# Altium schematic sheet optOutput.SchDoc
size 420 x 297 mm; Scale: 1:1; DocumentType: Схема электрическая принципиальная; FirstReferrence: АБВГ.123456.001
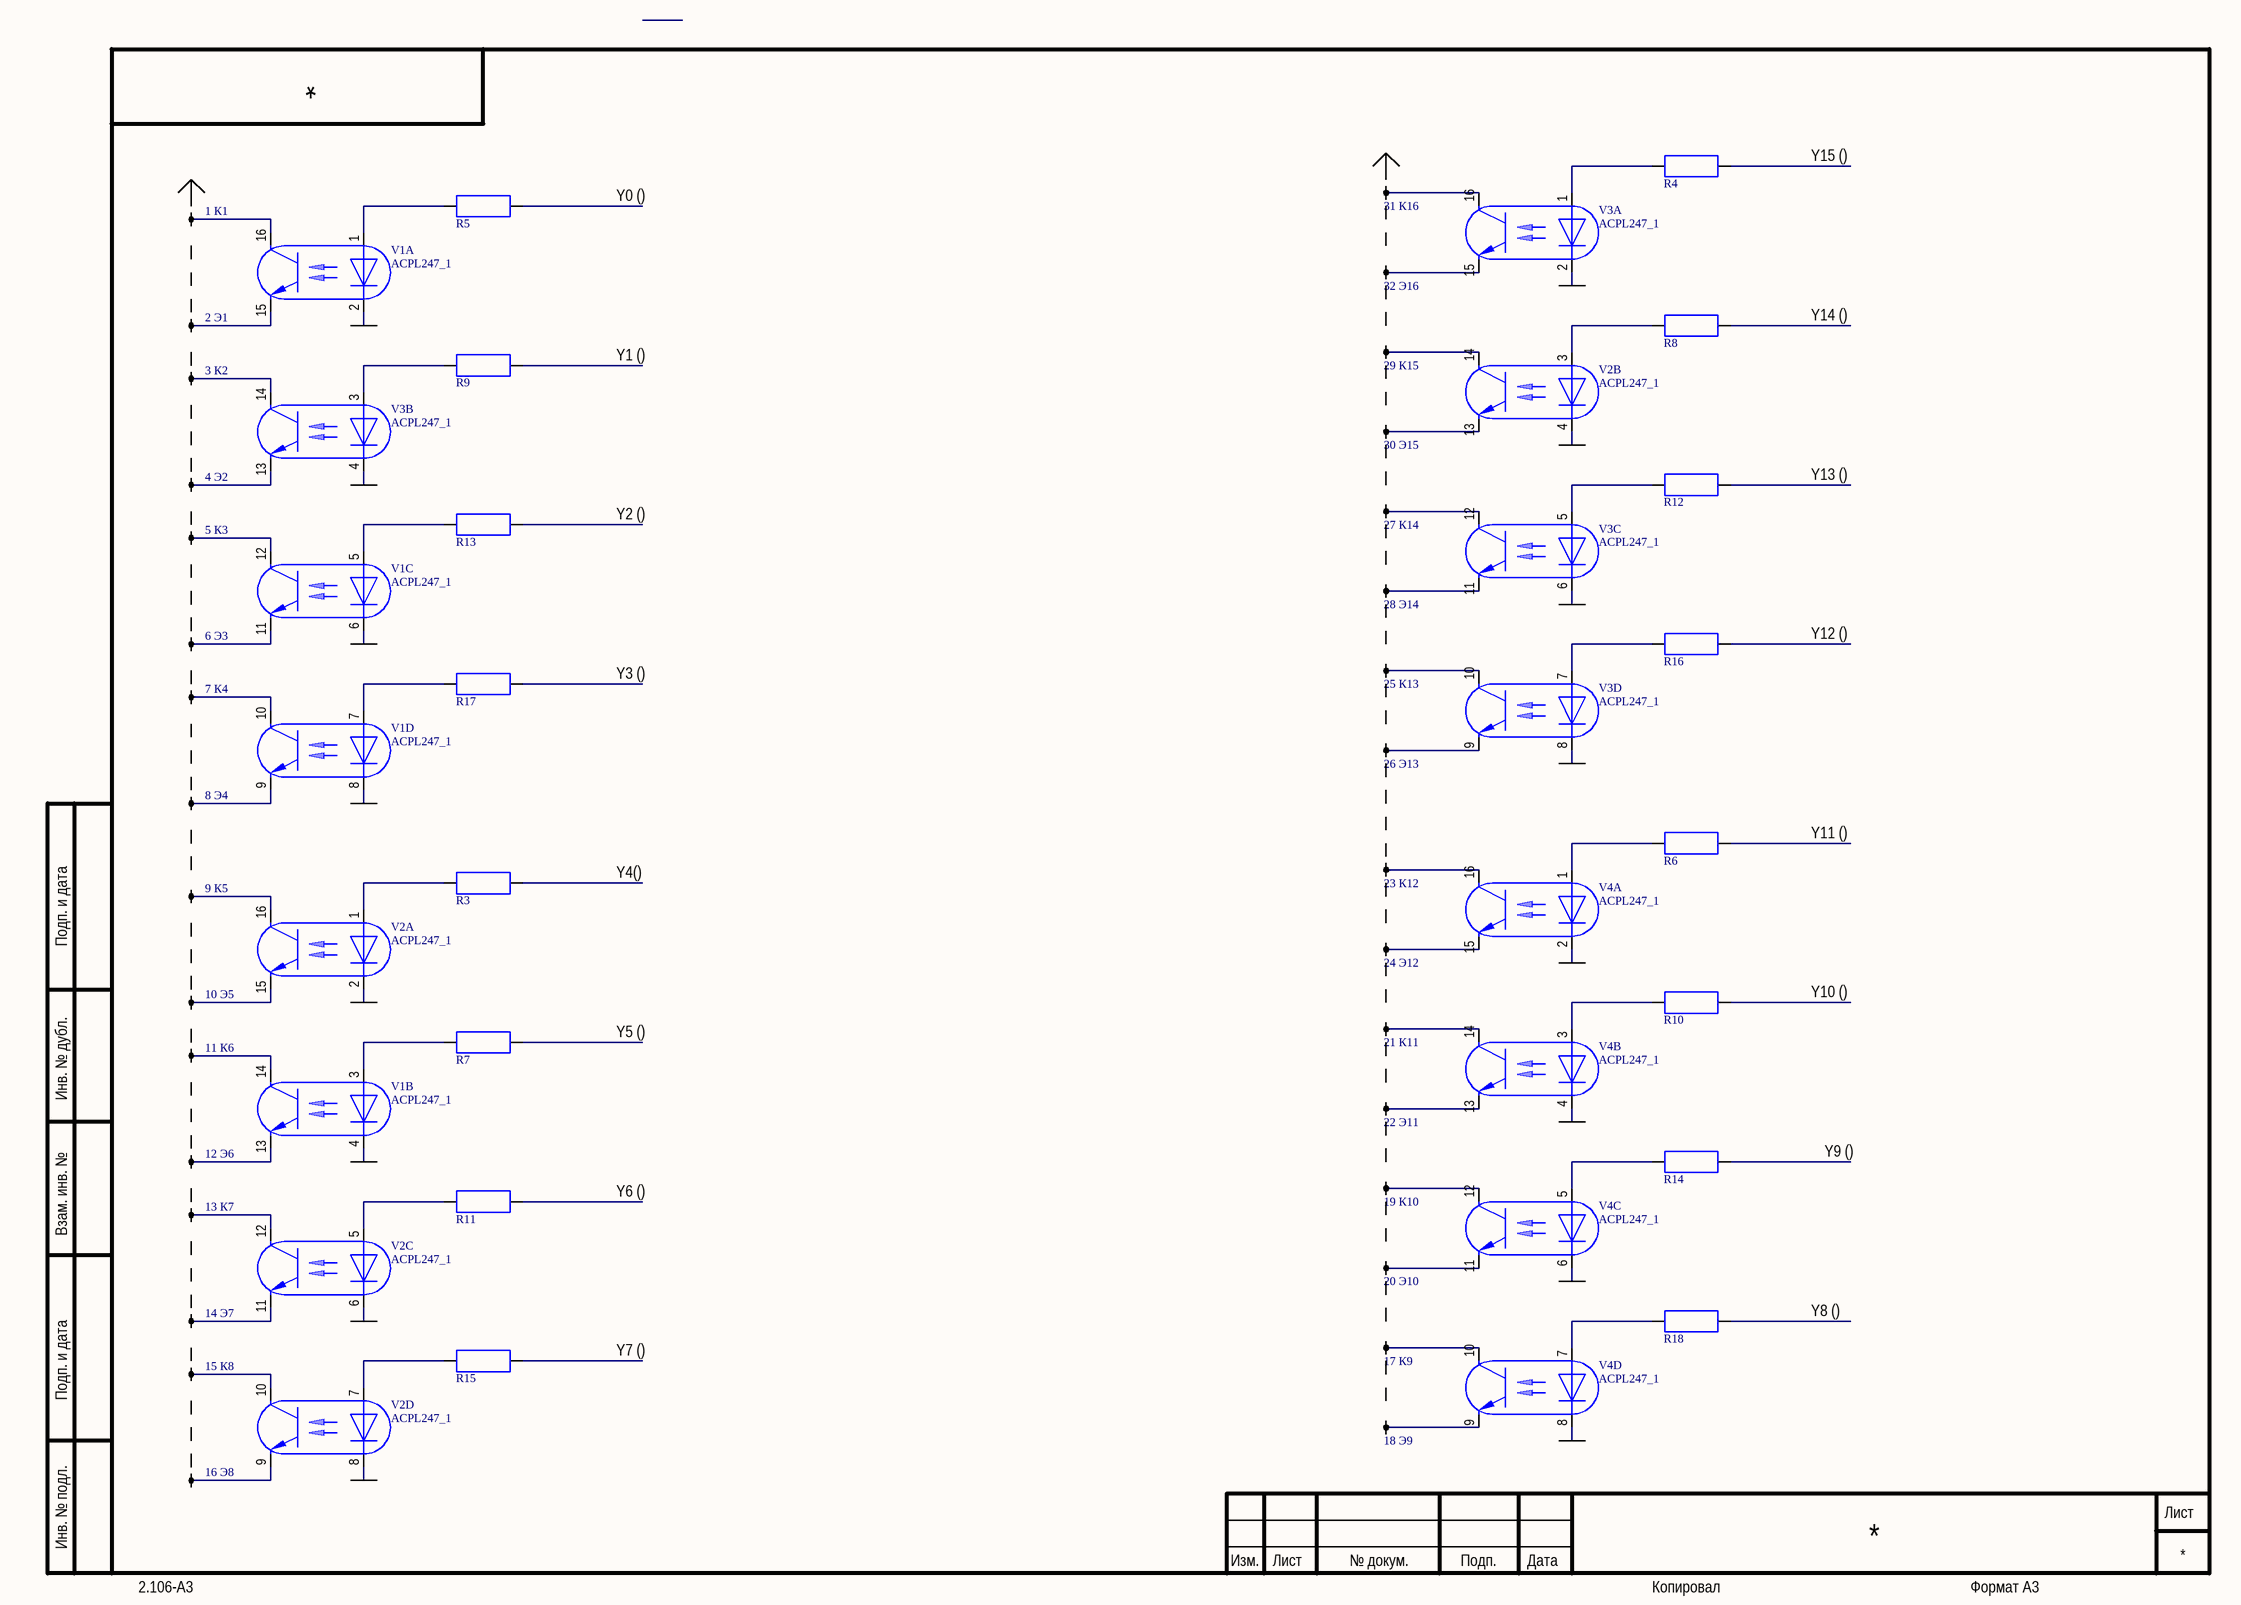
[diagram p0: optOutput.SchDoc]

## Parts
(Parts that share a designator on the sheet are numbered #1, #2 ... from top to bottom, then left to right.)
R3  R_1  (value not drawn)
R4  R_1  (value not drawn)
R5  R_1  (value not drawn)
R6  R_1  (value not drawn)
R7  R_1  (value not drawn)
R8  R_1  (value not drawn)
R9  R_1  (value not drawn)
R10  R_1  (value not drawn)
R11  R_1  (value not drawn)
R12  R_1  (value not drawn)
R13  R_1  (value not drawn)
R14  R_1  (value not drawn)
R15  R_1  (value not drawn)
R16  R_1  (value not drawn)
R17  R_1  (value not drawn)
R18  R_1  (value not drawn)
V1  ACPL247_1  [SOP127P700X220-16N]  (parts A,B,C,D of 4)
V2  ACPL247_1  [SOP127P700X220-16N]  (parts A,B,C,D of 4)
V3  ACPL247_1  [SOP127P700X220-16N]  (parts A,B,C,D of 4)
V4  ACPL247_1  [SOP127P700X220-16N]  (parts A,B,C,D of 4)
X2#1  1 К1  [PLD64]  (parts A,B,C,D,H,I,J,K,L,M,N,O,P,Q,R,S,T,U,V,W,X,Y,Z,27,28,29,30,31,32 of 64)
X2#2  5 К3  [PLD64]  (part E of 64)
X2#3  6 Э3  [PLD64]  (part F of 64)
X2#4  7 К4  [PLD64]  (part G of 64)

## Nets
NetR3_1: R3.1 V2.1
NetR4_1: R4.1 V3.1
NetR5_1: R5.1 V1.1
NetR6_1: R6.1 V4.1
NetR7_1: R7.1 V1.3
NetR8_1: R8.1 V2.3
NetR9_1: R9.1 V3.3
NetR10_1: R10.1 V4.3
NetR11_1: R11.1 V2.5
NetR12_1: R12.1 V3.5
NetR13_1: R13.1 V1.5
NetR14_1: R14.1 V4.5
NetR15_1: R15.1 V2.7
NetR16_1: R16.1 V3.7
NetR17_1: R17.1 V1.7
NetR18_1: R18.1 V4.7
NetV1_9: V1.9 X2#1.8
NetV1_10: V1.10 X2#4.43
NetV1_11: V1.11 X2#3.41
NetV1_12: V1.12 X2#2.39
NetV1_13: V1.13 X2#1.12
NetV1_14: V1.14 X2#1.11
NetV1_15: V1.15 X2#1.2
NetV1_16: V1.16 X2#1.1
NetV2_9: V2.9 X2#1.16
NetV2_10: V2.10 X2#1.15
NetV2_11: V2.11 X2#1.14
NetV2_12: V2.12 X2#1.13
NetV2_13: V2.13 X2#1.30
NetV2_14: V2.14 X2#1.29
NetV2_15: V2.15 X2#1.10
NetV2_16: V2.16 X2#1.9
NetV3_9: V3.9 X2#1.26
NetV3_10: V3.10 X2#1.25
NetV3_11: V3.11 X2#1.28
NetV3_12: V3.12 X2#1.27
NetV3_13: V3.13 X2#1.4
NetV3_14: V3.14 X2#1.3
NetV3_15: V3.15 X2#1.32
NetV3_16: V3.16 X2#1.31
NetV4_9: V4.9 X2#1.18
NetV4_10: V4.10 X2#1.17
NetV4_11: V4.11 X2#1.20
NetV4_12: V4.12 X2#1.19
NetV4_13: V4.13 X2#1.22
NetV4_14: V4.14 X2#1.21
NetV4_15: V4.15 X2#1.24
NetV4_16: V4.16 X2#1.23

Not connected (* = marked no-connect by the designer): R3 2; R4 2; R5 2; R6 2; R7 2; R8 2; R9 2; R10 2; R11 2; R12 2; R13 2; R14 2; R15 2; R16 2; R17 2; R18 2; V1 2 4 6 8; V2 2 4 6 8; V3 2 4 6 8; V4 2 4 6 8

## Notes on the sheet
- Y0 ()
- Y15 ()
- Y14 ()
- Y1 ()
- Y13 ()
- Y2 ()
- Y3 ()
- Y12 ()
- Y4()
- Y11 ()
- Y10 ()
- Y5 ()
- Y6 ()
- Y9 ()
- Y7 ()
- Y8 ()
- Подп. и дата
- Инв. № дубл.
- Взам. инв. №
- Инв. № подл.
- Изм.
- Лист
- № докум.
- Подп.
- Дата
- 2.106-A3
- Копировал
- Формат А3

## Library data of the parts
X2#1-X2#4 = PLD64